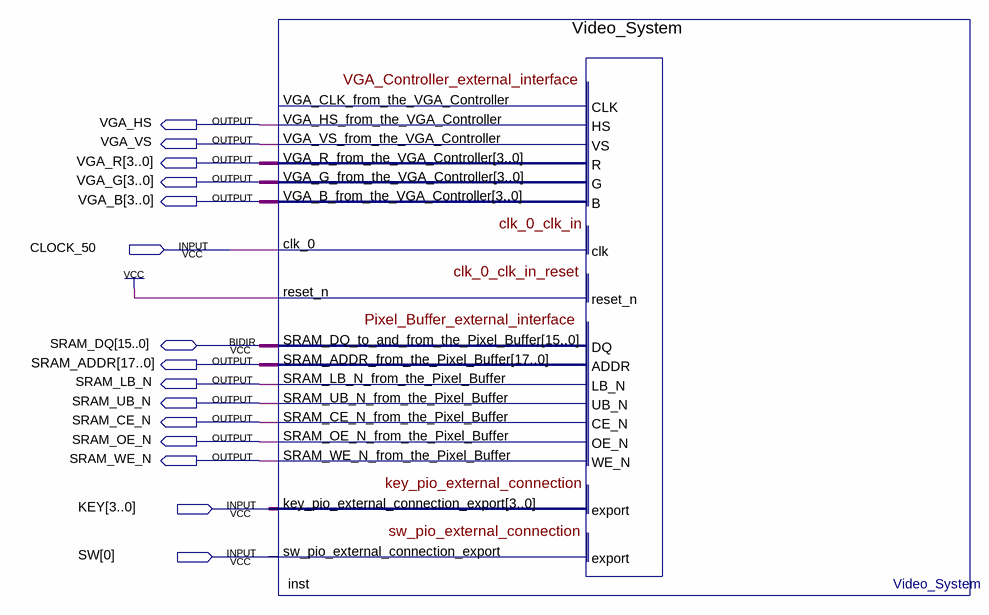
[diagram p0: schematic sheet]
// Quartus schematic SoccerGame.bdf as structural Verilog: 1 symbols, 15 pins
module SoccerGame (
  input  CLOCK_50,
  input  [3:0] KEY,
  input  [0:0] SW,
  inout  [15:0] SRAM_DQ,
  output VGA_HS,
  output VGA_VS,
  output [3:0] VGA_R,
  output [3:0] VGA_G,
  output [3:0] VGA_B,
  output [17:0] SRAM_ADDR,
  output SRAM_LB_N,
  output SRAM_UB_N,
  output SRAM_CE_N,
  output SRAM_OE_N,
  output SRAM_WE_N
);

  Video_System inst (
    .clk_0(CLOCK_50), .reset_n(1'b1), .key_pio_external_connection_export(KEY),
    .sw_pio_external_connection_export(SW[0]), .VGA_HS_from_the_VGA_Controller(VGA_HS),
    .VGA_VS_from_the_VGA_Controller(VGA_VS), .VGA_R_from_the_VGA_Controller(VGA_R),
    .VGA_G_from_the_VGA_Controller(VGA_G), .VGA_B_from_the_VGA_Controller(VGA_B),
    .SRAM_ADDR_from_the_Pixel_Buffer(SRAM_ADDR), .SRAM_LB_N_from_the_Pixel_Buffer(SRAM_LB_N),
    .SRAM_UB_N_from_the_Pixel_Buffer(SRAM_UB_N), .SRAM_CE_N_from_the_Pixel_Buffer(SRAM_CE_N),
    .SRAM_OE_N_from_the_Pixel_Buffer(SRAM_OE_N), .SRAM_WE_N_from_the_Pixel_Buffer(SRAM_WE_N),
    .SRAM_DQ_to_and_from_the_Pixel_Buffer(SRAM_DQ));  // open: VGA_CLK_from_the_VGA_Controller
endmodule
